# EAGLE design ciborg-2 (EAGLE 4.13)
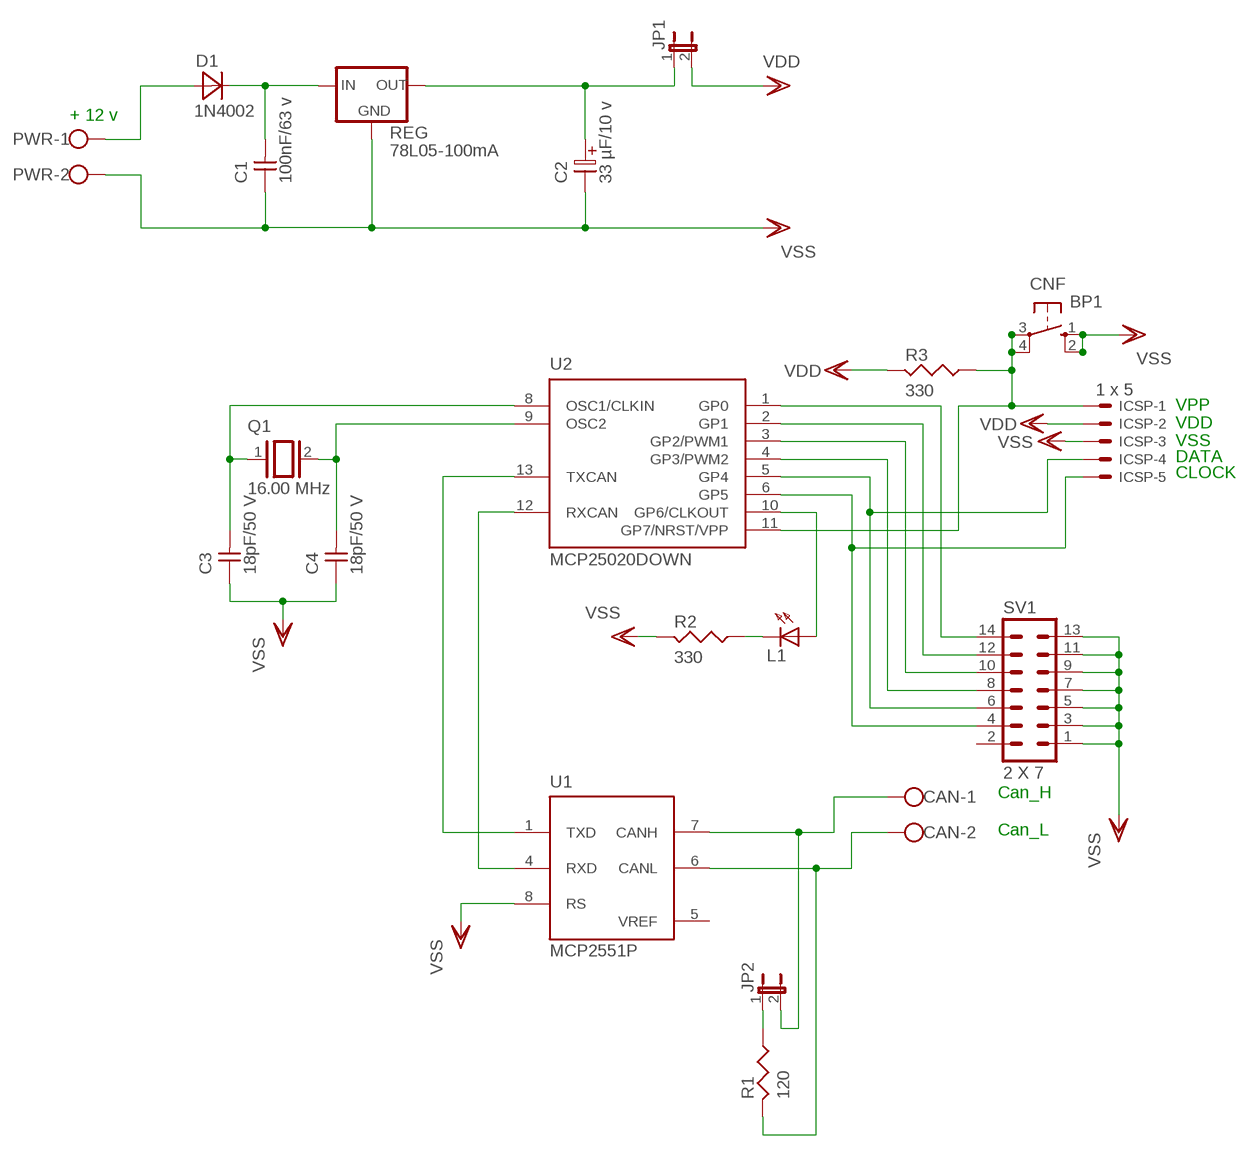
[diagram p0: schematic, sheet 1]

## Parts
C1  100nF/63 v  CAPNP-5  [C-5]
C2  33 µF/10 v  ELC-2,5L  [ES-2,5L]
C3  18pF/50 V  CAPNP-5  [C-5]
C4  18pF/50 V  CAPNP-5  [C-5]
CAN  AK550/2  [AK550/2]
CNF  BP1  10-XX  [B3F-10XX]
D1  1N4002  DIODE-10  [D-10]
ICSP  1 x 5  53047-05  [53047-05]
JP1  JP1E  [JP1]
JP2  JP1E  [JP1]
L1  LED3MM  [LED3MM]
PWR  AK550/2  [AK550/2]
Q1  16.00 MHz  XTAL/S  [QS]
R1  120  RESUS-10  [R-10]
R2  330  RESUS-S2,5  [RS-2,5]
R3  330  RESUS-S2,5  [RS-2,5]
REG  78L05-100mA  78LXX  [78LXX]
SV1  2 X 7  MA07-2  [MA07-2]
U1  MCP2551P  [DIL8]
U2  MCP25020DOWN  [SO-14DOWN]

## Nets
N$1: L1.K(C) R2.1
N$2: C2.1 JP1.1 REG.OUT
N$3: C4.2 Q1.2 U2.9(OSC2)
N$4: JP2.1 R1.1
N$5: ICSP.5 SV1.4 U2.6(GP5)
N$6: C3.2 Q1.1 U2.8(OSC1/CLKIN)
N$7: C1.2 D1.2(K) REG.IN
N$8: U1.4(RXD) U2.12(RXCAN)
N$9: U1.1(TXD) U2.13(TXCAN)
N$10: SV1.14 U2.1(GP0)
N$11: SV1.12 U2.2(GP1)
N$12: SV1.10 U2.3(GP2/PWM1)
N$13: SV1.8 U2.4(GP3/PWM2)
N$14: ICSP.4 SV1.6 U2.5(GP4)
N$16: L1.A U2.10(GP6/CLKOUT)
N$19: CAN.2 R1.2 U1.6(CANL)
N$20: CAN.1 JP2.2 U1.7(CANH)
N$21: D1.1(A) PWR.1
VDD: ICSP.2 JP1.2 R3.2
VPP: CNF.3(P) CNF.4(P1) ICSP.1 R3.1 U2.11(GP7/NRST/VPP)
VSS: C1.1 C2.2 C3.1 C4.1 CNF.1(S) CNF.2(S1) ICSP.3 PWR.2 R2.2 REG.GND SV1.1 SV1.3 SV1.5 SV1.7 SV1.9 SV1.11 SV1.13 U1.8(RS)
Unconnected: SV1.2

## Notes on the sheet
- + 12 v
- VPP
- VDD
- VSS
- DATA
- CLOCK
- Can_H
- Can_L

## Power pins joined to a net without a drawn wire
VDD: U1.3(VDD) U2.14(VDD)
VREF: U1.5(VREF)
VSS: U1.2(VSS) U2.7(VSS)

## Library data of the parts
C1 C3 C4 = discrete:CAPNP-5
C2 = discrete:ELC-2,5L
CAN PWR = con-ptr500+:AK550/2: CONNECTOR
CNF = switch-omron:10-XX: OMRON SWITCH
D1 = discrete:DIODE-10
ICSP = con-molex:53?-05: CONNECTOR wire to board 1.25 mm (.049 inch) pitch header
JP1 JP2 = jumper:JP1E: JUMPER
L1 = led:LED: LED
Q1 = special:XTAL/S: CRYSTAL
R1 = discrete:RESUS-10
R2 R3 = discrete:RESUS-S2,5
REG = v-reg:78LXX: VOLTAGE REGULATOR
SV1 = con-lstb:MA07-2: PIN HEADER
U1 = microchip_can:MCP2551: High Speed CAN tranceiver
U2 = microchip_can:MCP25020: CAN I/O Expander

## Net classes
0 default: width 0.254 mm, drill 0.254 mm

## Board
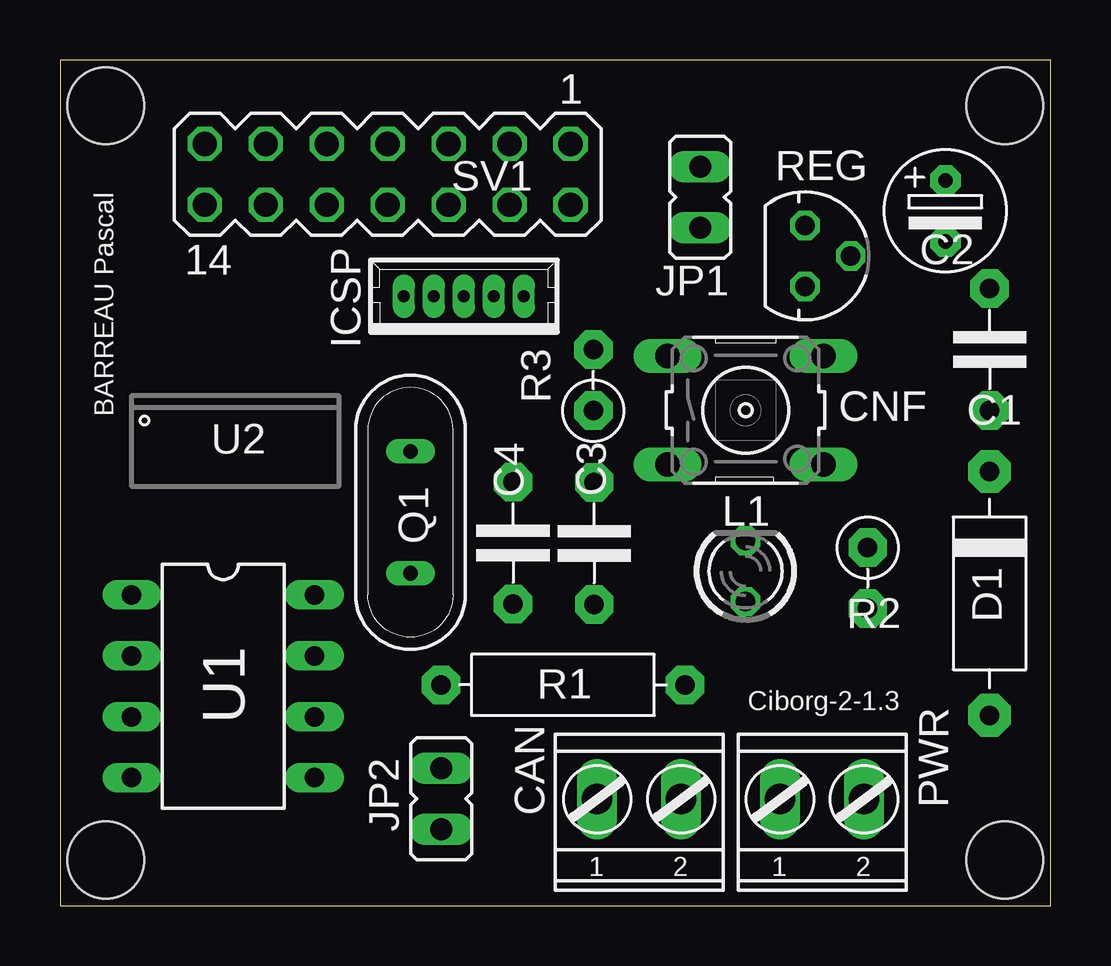
[diagram p1: board, top side]
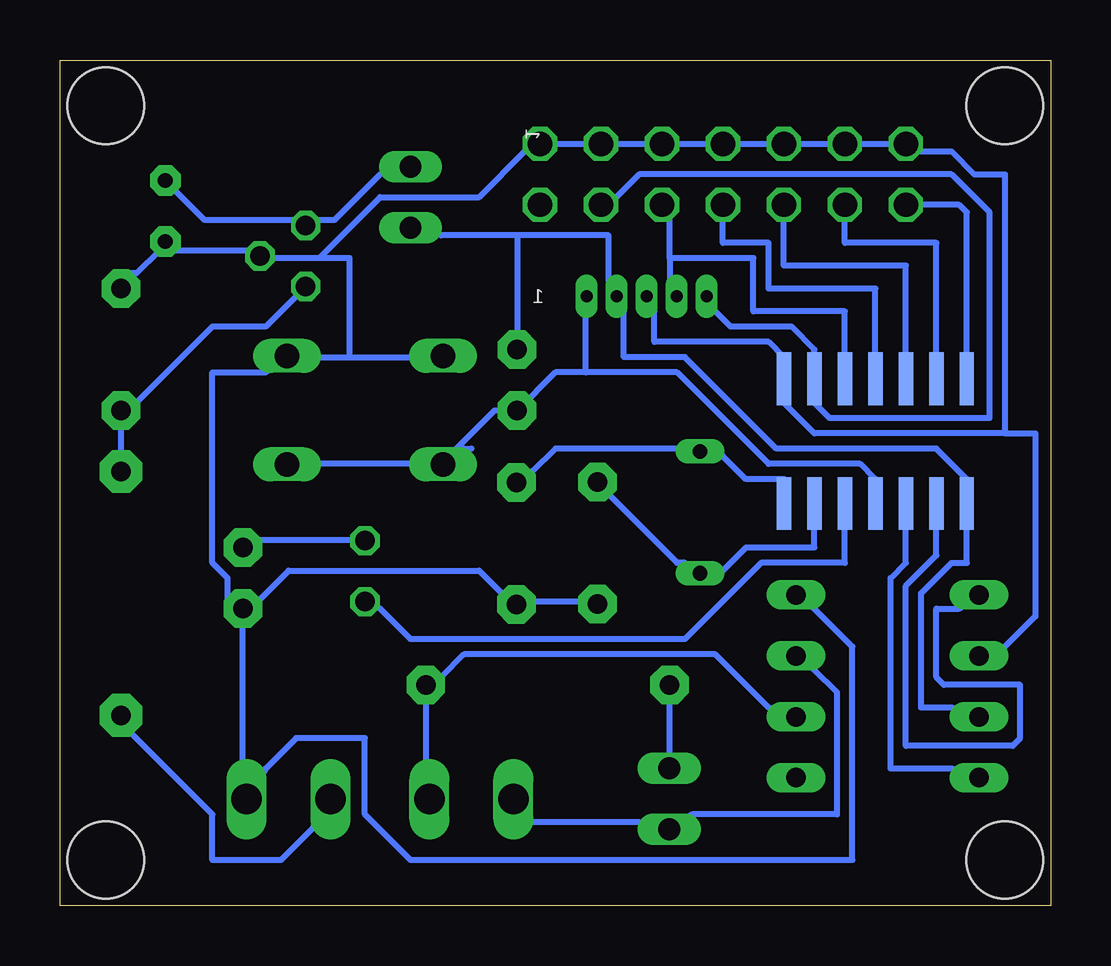
[diagram p2: board, bottom side, seen from below]

Size 41.27 x 35.24 mm. Coordinates in mm from the lower left corner, seen from the top.
Outline: 0,0 41.27,0 41.27,35.24 0,35.24 0,0
Copper layers (1*16): Top 0.035mm / dielectric 1.5mm / Bottom 0.035mm
Design rules "paco": minimum track width 10mil, minimum drill 19mil, track to track 10mil, track to pad 10mil, pad to pad 10mil, via to via 10mil, smd to smd 10mil, copper to edge 20mil, drill to drill 10mil, minimum pad ring 8mil, minimum via ring 6mil, stop-mask expansion 3mil, vias tented up to drill 0mil, thermal gap 8mil
Holes 3.2 mm at 1.91,1.91 39.37,1.91 39.37,33.34 1.91,33.34

### Footprints (pad centres in the part's own frame; a part is rotated, then mirrored left to right if it is on the bottom)
C-5 = drill 0.813 pad 1.6 octagon: 1 -2.54,0; 2 2.54,0
ES-2,5L = drill 0.61 pad 1.27 octagon: 1 0,0; 2 2.54,0
AK550/2 = drill 1.27 long: 1 -1.75,0; 2 1.75,0
B3F-10XX = drill 1.016 long: 1 -3.251,2.261; 2 3.251,2.261; 3 -3.251,-2.261; 4 3.251,-2.261
D-10 = drill 0.813 pad 1.778 octagon: 1 -5.08,0; 2 5.08,0
53047-05 = drill 0.5 pad 0.698 long: 1 2.5,0; 2 1.25,0; 3 0,0; 4 -1.25,0; 5 -2.5,0
JP1 = drill 0.914 long: 1 0,-1.27; 2 0,1.27
LED3MM = drill 0.813 octagon: A -1.27,0; K 1.27,0
QS = drill 0.61 long: 1 -2.54,0; 2 2.54,0
R-10 = drill 0.813 pad 1.6 octagon: 1 -5.08,0; 2 5.08,0
RS-2,5 = drill 0.813 pad 1.6 octagon: 1 0,0; 2 2.54,0
78LXX = drill 0.813 octagon: GND 0,1.905; IN 1.27,0; OUT -1.27,0
MA07-2 = drill 1.016 octagon: 1 -7.62,-1.27; 2 -7.62,1.27; 3 -5.08,-1.27; 4 -5.08,1.27; 5 -2.54,-1.27; 6 -2.54,1.27; 7 0,-1.27; 8 0,1.27; 9 2.54,-1.27; 10 2.54,1.27; 11 5.08,-1.27; 12 5.08,1.27; 13 7.62,-1.27; 14 7.62,1.27
DIL8 = drill 0.813 long: 1 -3.81,-3.81; 2 -1.27,-3.81; 3 1.27,-3.81; 4 3.81,-3.81; 5 3.81,3.81; 6 1.27,3.81; 7 -1.27,3.81; 8 -3.81,3.81
SO-14DOWN = smd 0.6 x 2.2 bottom: 1 3.81,-2.6; 2 2.54,-2.6; 3 1.27,-2.6; 4 0,-2.6; 5 -1.27,-2.6; 6 -2.54,-2.6; 7 -3.81,-2.6; 8 -3.81,2.6; 9 -2.54,2.6; 10 -1.27,2.6; 11 0,2.6; 12 1.27,2.6; 13 2.54,2.6; 14 3.81,2.6

### Placement (x,y rotation side)
C1  38.73,23.18 270 top
C2  36.89,30.23 270 top
C3  22.26,15.1 90 top
C4  18.88,15.12 90 top
CAN  24.13,4.45 0 top
CNF  28.57,20.65 0 top
D1  38.73,13.02 90 top
ICSP  16.83,25.4 0 top
JP1  26.67,29.53 180 top
JP2  15.89,4.46 180 top
L1  28.56,13.94 90 top
PWR  31.75,4.45 0 top
Q1  14.6,16.4 270 top
R1  20.95,9.21 0 top
R2  33.66,14.92 270 top
R3  22.23,20.64 90 top
REG  31.04,27.08 270 top
SV1  13.65,30.48 180 top
U1  6.8,9.15 270 top
U2  7.3,19.37 180 top

### Tracks (layer width: path | path; a pad name or v marks a point on that pad's centre or on a via)
N$1
  Bottom 0.254: L1.K 29.21,15.24 33.02,15.24 R2.1
N$2
  Bottom 0.254: C2.1 36.51,29.84 35.24,28.57 31.43,28.57 REG.OUT 30.48,28.57 29.84,28.57 27.94,30.48 JP1.1
N$3
  Bottom 0.254: U2.9 9.84,14.92 12.7,14.92 13.65,13.97 Q1.2 15.24,14.29 15.56,14.29 18.41,17.14 C4.2
N$4
  Bottom 0.254: JP2.1 15.88,6.35 R1.1
N$5
  Bottom 0.254: SV1.4 18.1,29.53 17.14,30.48 4.13,30.48 2.54,28.89 2.54,20.32 9.21,20.32 9.84,20.95 U2.6 9.84,23.18 10.79,24.13 13.34,24.13 13.97,24.77 ICSP.5
N$6
  Bottom 0.254: U2.8 11.11,17.78 12.7,17.78 13.65,18.73 Q1.1 15.56,19.05 20.64,19.05 21.59,18.1 C3.2
N$7
  Bottom 0.254: REG.IN 31.43,25.4 32.7,24.13 34.92,24.13 38.1,20.95 C1.2 D1.2
N$8
  Bottom 0.254: U2.12 6.03,14.29 6.67,13.65 6.67,5.71 4.13,5.71 U1.4
N$9
  Bottom 0.254: U2.13 4.76,14.61 6.03,13.34 6.03,6.67 1.59,6.67 1.27,6.99 1.27,9.21 4.45,9.21 4.76,9.53 4.76,12.38 3.81,12.38 U1.1
N$10
  Bottom 0.254: U2.1 3.49,28.89 3.81,29.21 SV1.14
N$11
  Bottom 0.254: U2.2 4.76,27.62 8.57,27.62 SV1.12
N$12
  Bottom 0.254: U2.3 6.03,26.67 11.11,26.67 SV1.10
N$13
  Bottom 0.254: U2.4 7.3,25.72 11.75,25.72 11.75,27.62 13.65,27.62 SV1.8
N$14
  Bottom 0.254: U2.5 8.57,24.77 12.38,24.77 12.38,26.99 15.88,26.99 | SV1.6 15.88,29.21 15.88,26.99 | 15.88,26.99 15.88,26.04 ICSP.4
N$16
  Bottom 0.254: U2.10 8.57,14.29 12.06,14.29 15.24,11.11 26.67,11.11 27.94,12.38 L1.A
N$19
  Bottom 0.254: U1.6 11.75,8.26 13.97,10.48 24.45,10.48 25.4,9.53 R1.2 26.04,6.03 CAN.2
N$20
  Bottom 0.254: U1.7 9.84,9.84 8.89,8.89 8.89,3.81 14.92,3.81 JP2.2 17.14,3.49 21.59,3.49 CAN.1
N$21
  Bottom 0.254: D1.1 38.42,7.3 34.92,3.81 34.92,1.91 32.07,1.91 30.8,3.17 PWR.1
VDD
  Bottom 0.254: U1.3 4.13,8.26 5.4,8.26 5.4,13.02 4.13,14.29 3.49,14.29 U2.14 3.49,17.78 4.76,19.05 11.43,19.05 15.24,22.86 17.78,22.86 17.78,24.77 ICSP.2 18.41,26.04 18.41,27.94 22.23,27.94 | JP1.2 25.4,27.94 22.23,27.94 | 22.23,27.94 R3.2
VPP
  Bottom 0.254: 24.13,19.05 24.45,19.05 CNF.3 | 19.37,22.23 15.56,22.23 11.75,18.41 7.94,18.41 7.3,17.78 U2.11 | CNF.4 30.48,18.41 26.67,18.41 CNF.3 | 19.37,22.23 19.37,24.77 ICSP.1 | 19.37,22.23 20.64,22.23 R3.1 23.18,20.64 25.4,18.41 25.38,18.39 CNF.3
VSS
  Bottom 0.254: C4.1 19.37,12.7 21.59,12.7 C3.1 22.86,13.02 23.81,13.97 31.75,13.97 33.02,12.7 R2.2 | U1.8 9.84,12.38 8.26,10.79 8.26,1.91 26.67,1.91 28.57,3.81 28.57,6.99 31.43,6.99 32.7,5.71 PWR.2 33.66,6.03 R2.2 | 1.91,19.68 9.84,19.68 11.11,20.95 U2.7 11.11,22.86 11.75,23.5 16.51,23.5 16.51,24.77 ICSP.3 | 29.21,22.86 30.48,22.86 CNF.2 32.7,22.23 34.92,22.23 34.92,14.29 34.29,13.65 34.29,12.7 R2.2 | 29.21,22.86 26.67,22.86 CNF.1 | C1.1 38.42,26.35 38.1,26.35 37.15,27.3 C2.2 36.51,27.3 33.34,27.3 REG.GND 32.38,26.99 30.48,26.99 | 29.21,22.86 29.21,26.99 30.48,26.99 | 30.48,26.99 27.94,29.53 23.81,29.53 21.91,31.43 SV1.1 SV1.3 SV1.5 SV1.7 SV1.9 SV1.11 SV1.13 5.4,31.43 4.13,31.43 3.17,30.48 1.91,30.48 1.91,19.68 | 1.91,19.68 0.64,19.68 0.64,12.06 1.91,10.79 U1.2

### Text on the board
bPlace: 1 | 1
tNames: BARREAU Pascal | Ciborg-2-1.3